# EAGLE design PIC 16F877A Board_V4 (EAGLE 9.6.2)
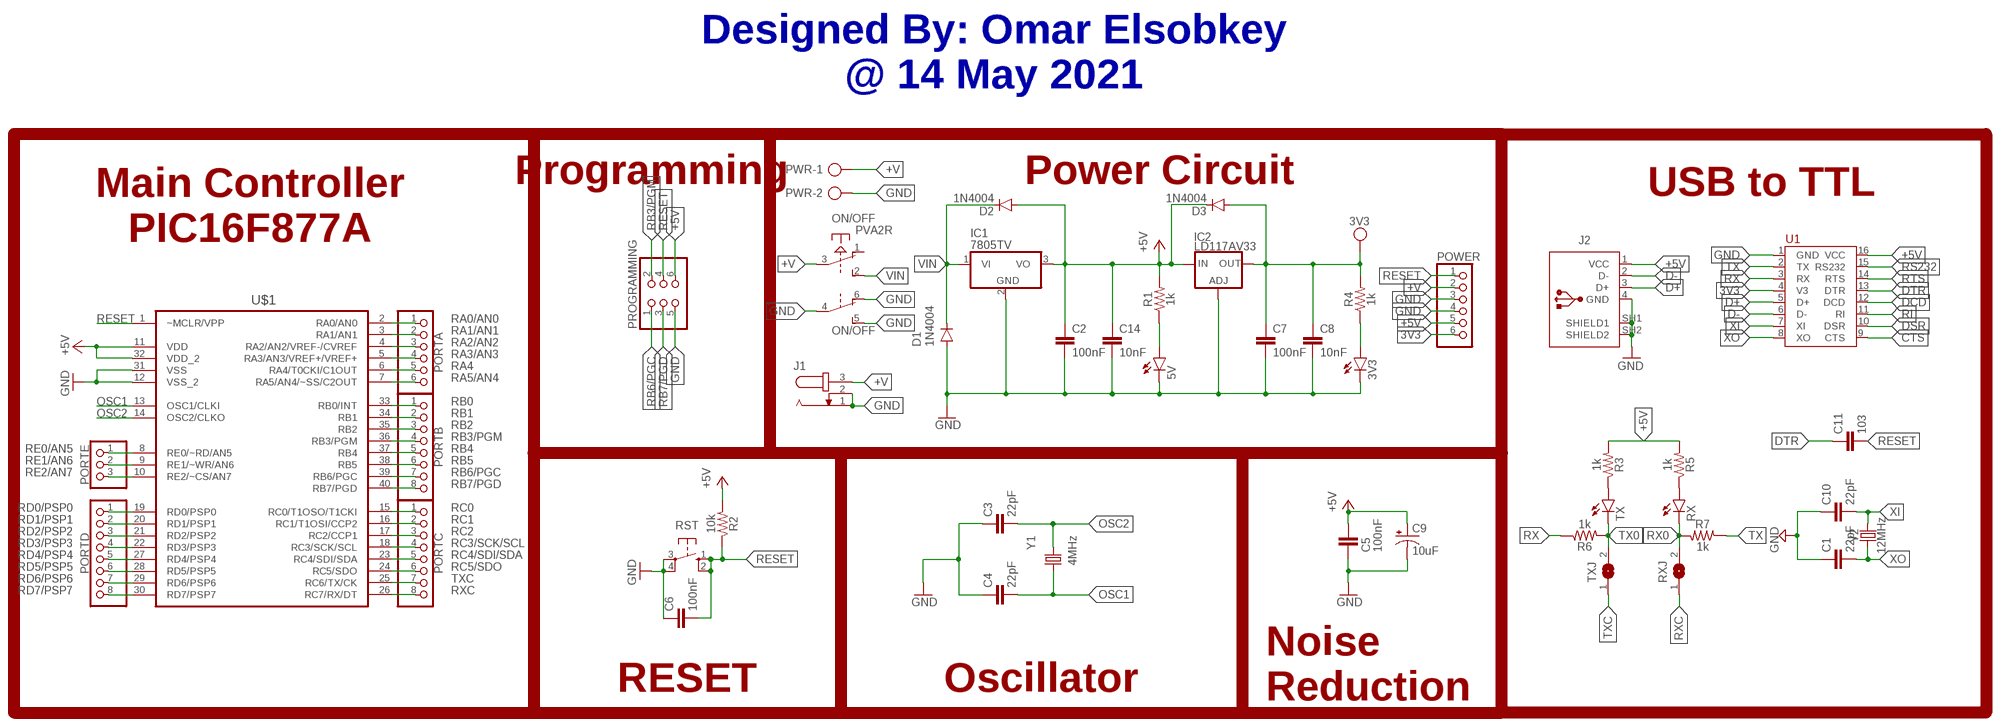
[diagram p0: schematic, sheet 1]

## Parts
3V3  LED3MM  [LED3MM]
5V  LED3MM  [LED3MM]
C1  22pF  C-EU025-025X050  [C025-025X050]
C2  100nF  C-EU025-025X050  [C025-025X050]
C3  22pF  C-EU025-025X050  [C025-025X050]
C4  22pF  C-EU025-025X050  [C025-025X050]
C5  100nF  C-EU025-025X050  [C025-025X050]
C6  100nF  C-EU025-025X050  [C025-025X050]
C7  100nF  C-EU025-025X050  [C025-025X050]
C8  10nF  C-EU025-025X050  [C025-025X050]
C9  10uF  10UF-POLAR-RADIAL-2.5MM-KIT-25V-20%  [CPOL-RADIAL-2.5MM-5MM-KIT]
C10  22pF  C-EU025-025X050  [C025-025X050]
C11  103  C-EU025-025X050  [C025-025X050]
C14  10nF  C-EU025-025X050  [C025-025X050]
D1  1N4004  [DO41-10]
D2  1N4004  [DO41-10]
D3  1N4004  [DO41-10]
IC1  7805TV  [TO220V]
IC2  LD117AV33  [TO220L1]
J1  JACK-PLUG0  [SPC4077]
J2  61729-1011  [61729-1011BLF]
ON/OFF  PVA2R  [PVA2R]
PORTA  PINHD-1X6  [1X06]
PORTB  PINHD-1X8  [1X08]
PORTC  PINHD-1X8  [1X08]
PORTD  PINHD-1X8  [1X08]
PORTE  PINHD-1X3  [1X03]
POWER  PINHD-1X6  [1X06]
PROGRAMMING  PINHD-2X3  [2X03]
PWR  AK500/2-H  [AK500/2-H]
R1  1k  RESISTOR1206  [1206]
R2  10k  RESISTOR1206  [1206]
R3  1k  RESISTOR1206  [1206]
R4  1k  RESISTOR1206  [1206]
R5  1k  RESISTOR1206  [1206]
R6  1k  RESISTOR1206  [1206]
R7  1k  RESISTOR1206  [1206]
RST  10-XX  [B3F-10XX]
RX  LED3MM  [LED3MM]
RXJ  SJW  [SJW]
TX  LED3MM  [LED3MM]
TXJ  SJW  [SJW]
U1  CH340G  [SOP-16]
U$1  PIC16F877A-I/P  [PDIP-40]
Y1  4MHz  CRYSTALPTH-HC49UV  [HC49U]
Y2  12MHz  CRYSTALPTH-HC49UV  [HC49U]

## Nets
3V3: C7.1 C8.1 D3.A IC2.2(OUT) POWER.6 R4.2 U1.4(V3)
+5V: C2.1 C5.2 C9.1(+) C14.1 D2.A D3.C IC1.3(VO) IC2.3(IN) J2.1(VCC) POWER.5 PROGRAMMING.6 R1.2 R2.2 R3.2 R5.2 U1.16(VCC) U$1.11(VDD) U$1.32(VDD_2)
+V: J1.3 ON/OFF.3(1:P) POWER.2 PWR.1
CTS: U1.9(CTS)
D+: J2.3(D+) U1.5(D+)
D-: J2.2(D-) U1.6(D-)
DCD: U1.12(DCD)
DSR: U1.10(DSR)
DTR: C11.1 U1.13(DTR)
GND: 3V3.K(C) 5V.K(C) C1.1 C2.2 C3.1 C4.1 C5.1 C6.1 C7.2 C8.2 C9.2(-) C10.1 C14.2 D1.A IC1.2(GND) IC2.1(ADJ) J1.1 J1.2 J2.4(GND) J2.SH1(SHIELD1) J2.SH2(SHIELD2) ON/OFF.4(2:P) ON/OFF.5(2:S) ON/OFF.6(2:O) POWER.3 POWER.4 PROGRAMMING.5 PWR.2 RST.3(P) RST.4(P1) U1.1(GND) U$1.12(VSS_2) U$1.31(VSS)
N$1: 3V3.A R4.1
N$2: R3.1 TX.A
N$3: R5.1 RX.A
N$4: 5V.A R1.1
OSC1: C4.2 U$1.13(OSC1/CLKI) Y1.2
OSC2: C3.2 U$1.14(OSC2/CLKO) Y1.1
RA0/AN0: PORTA.1 U$1.2(RA0/AN0)
RA1/AN1: PORTA.2 U$1.3(RA1/AN1)
RA2/AN2: PORTA.3 U$1.4(RA2/AN2/VREF-/CVREF)
RA3/AN3: PORTA.4 U$1.5(RA3/AN3/VREF+/VREF+)
RA4: PORTA.5 U$1.6(RA4/T0CKI/C1OUT)
RA5/AN4: PORTA.6 U$1.7(RA5/AN4/~SS/C2OUT)
RB0: PORTB.1 U$1.33(RB0/INT)
RB1: PORTB.2 U$1.34(RB1)
RB2: PORTB.3 U$1.35(RB2)
RB3/PGM: PORTB.4 PROGRAMMING.2 U$1.36(RB3/PGM)
RB4: PORTB.5 U$1.37(RB4)
RB5: PORTB.6 U$1.38(RB5)
RB6/PGC: PORTB.7 PROGRAMMING.1 U$1.39(RB6/PGC)
RB7/PGD: PORTB.8 PROGRAMMING.3 U$1.40(RB7/PGD)
RC0: PORTC.1 U$1.15(RC0/T1OSO/T1CKI)
RC1: PORTC.2 U$1.16(RC1/T1OSI/CCP2)
RC2: PORTC.3 U$1.17(RC2/CCP1)
RC3/SCK/SCL: PORTC.4 U$1.18(RC3/SCK/SCL)
RC4/SDI/SDA: PORTC.5 U$1.23(RC4/SDI/SDA)
RC5/SDO: PORTC.6 U$1.24(RC5/SDO)
RD0/PSP0: PORTD.1 U$1.19(RD0/PSP0)
RD1/PSP1: PORTD.2 U$1.20(RD1/PSP1)
RD2/PSP2: PORTD.3 U$1.21(RD2/PSP2)
RD3/PSP3: PORTD.4 U$1.22(RD3/PSP3)
RD4/PSP4: PORTD.5 U$1.27(RD4/PSP4)
RD5/PSP5: PORTD.6 U$1.28(RD5/PSP5)
RD6/PSP6: PORTD.7 U$1.29(RD6/PSP6)
RD7/PSP7: PORTD.8 U$1.30(RD7/PSP7)
RE0/AN5: PORTE.1 U$1.8(RE0/~RD/AN5)
RE1/AN6: PORTE.2 U$1.9(RE1/~WR/AN6)
RE2/AN7: PORTE.3 U$1.10(RE2/~CS/AN7)
RESET: C6.2 C11.2 POWER.1 PROGRAMMING.4 R2.1 RST.1(S) RST.2(S1) U$1.1(~MCLR/VPP)
RI: U1.11(RI)
RS232: U1.15(RS232)
RTS: U1.14(RTS)
RX: R6.1 U1.3(RX)
RX0: R7.2 RX.K(C) RXJ.2
RXC: PORTC.8 RXJ.1 U$1.26(RC7/RX/DT)
TX: R7.1 U1.2(TX)
TX0: R6.2 TX.K(C) TXJ.2
TXC: PORTC.7 TXJ.1 U$1.25(RC6/TX/CK)
VIN: D1.C D2.C IC1.1(VI) ON/OFF.2(1:S)
XI: C10.2 U1.7(XI) Y2.2
XO: C1.2 U1.8(XO) Y2.1
Unconnected: ON/OFF.1(1:O)

## Notes on the sheet
- Designed By: Omar Elsobkey
  @ 14 May 2021
- Programming | Power Circuit | USB to TTL
- Main Controller
  PIC16F877A
- RESET | Oscillator
- Noise
  Reduction

## Library data of the parts
3V3 5V RX TX = led:LED: LED OSRAM: - CHIPLED LG R971, LG N971, LY N971, LG Q971, LY Q971, LO R971, LY R971 LH N974, LH R974 LS Q976, LO Q976, LY Q976 LO Q996 - Hyper CHIPLED LW Q18S LB Q993, LB Q99A, LB R99A - SideLED LS A670, LO A670, LY A670, LG A670, LP A670 LB A673, LV A673, LT A673, LW A673 LH A674 LY A675 LS A676, LA A676, LO A676, LY A676, LW A676 LS A679, LY A679, LG A679 - Hyper Micro SIDELED® LS Y876, LA Y876, LO Y876, LY Y876 LT Y87S - SmartLED LW L88C, LW L88S LB L89C, LB L89S, LG L890 LS L89K, LO L89K, LY L89K LS L896, LA L896, LO L896, LY L896 - TOPLED LS T670, LO T670, LY T670, LG T670, LP T670 LSG T670, LSP T670, LSY T670, LOP T670, LYG T670 LG T671, LOG T671, LSG T671 LB T673, LV T673, LT T673, LW T673 LH T674 LS T676, LA T676, LO T676, LY T676, LB T676, LH T676, LSB T676, LW T676 LB T67C, LV T67C, LT T67C, LS T67K, LO T67K, LY T67K, LW E67C LS E67B, LA E67B, LO E67B, LY E67B, LB E67C, LV E67C, LT E67C LW T67C LS T679, LY T679, LG T679 LS T770, LO T770, LY T770, LG T770, LP T770 LB T773, LV T773, LT T773, LW T773 LH T774 LS E675, LA E675, LY E675, LS T675 LS T776, LA T776, LO T776, LY T776, LB T776 LHGB T686 LT T68C, LB T68C - Hyper Mini TOPLED® LB M676 - Mini TOPLED Santana® LG M470 LS M47K, LO M47K, LY M47K Source: http://www.osram.convergy.de LUXEON: - LUMILED® LXK2-PW12-R00, LXK2-PW12-S00, LXK2-PW14-U00, LXK2-PW14-V00 LXK2-PM12-R00, LXK2-PM12-S00, LXK2-PM14-U00 LXK2-PE12-Q00, LXK2-PE12-R00, LXK2-PE12-S00, LXK2-PE14-T00, LXK2-PE14-U00 LXK2-PB12-K00, LXK2-PB12-L00, LXK2-PB12-M00, LXK2-PB14-N00, LXK2-PB14-P00, LXK2-PB14-Q00 LXK2-PR12-L00, LXK2-PR12-M00, LXK2-PR14-Q00, LXK2-PR14-R00 LXK2-PD12-Q00, LXK2-PD12-R00, LXK2-PD12-S00 LXK2-PH12-R00, LXK2-PH12-S00 LXK2-PL12-P00, LXK2-PL12-Q00, LXK2-PL12-R00 Source: www.luxeon.com KINGBRIGHT: KA-3528ASYC Source: www.kingbright.com
C1-C8 C10 C11 C14 = rcl:C-EU: CAPACITOR, European symbol; SPICEPREFIX: C
C9 = SparkFun-Capacitors:10UF-POLAR: 10.0µF polarized capacitors A capacitor is a passive two-terminal electrical component used to store electrical energy temporarily in an electric field.
D1-D3 = diode:1N4004: DIODE general purpose rectifier, 1 A
IC1 = linear:78*: Positive VOLTAGE REGULATOR Source: http://cache.national.com/ds/LM/LM78L05.pdf http://www.fairchildsemi.com/ds/LM/LM7805.pdf
IC2 = v-reg:LD117A?*: Low drop fixed and adjustable positive voltage regulators 1 A Source: http://www.st.com/stonline/products/literature/ds/7194/ld1117axx.pdf
J1 = con-jack:JACK-PLUG: DC POWER JACK Power Jack, DC, Right Angle, Through Hole, Rated 5A at 16VDC, PC Terminals Distributor: Farnell (www.Farnell.de) Drawing: 84N1161.pdf / 84N1162.pdf Manufacturer: SPC Technology (www.spctechnology.com) Type: SPC4077 / SPC 4078; OC_FARNELL: unknown; OC_NEWARK: unknown
J2 = Connector_USB:61729-1011: USB(2.0) Type-B, RCPT, 4POS, THT-R/A Datasheet <https://www.amphenol-icc.com/media/wysiwyg/files/drawing/61729.pdf>; CATEGORY: Connector; CONTACTS: 4; CURRENT_RATING: 1A; DESCRIPTION: CONN RCPT USB2.0 TYPEB 4POS R/A; GENDER: Receptacle; MANUFACTURER: Amphenol ICC (FCI); MOUNT_TYPE: R/A; MPN: 61729-1011BLF; OPERATING_TEMP: -55°C to 85°C; PART_STATUS: Active; ROHS_COMPLIANT: RoHS Compliant; SERIES: 61729; SUB-CATEGORY: USB; TYPE: USB-B
ON/OFF = switch-misc:PVA2R: ITT SWITCH
PORTA POWER = pinhead:PINHD-1X6: PIN HEADER
PORTB PORTC PORTD = pinhead:PINHD-1X8: PIN HEADER
PORTE = pinhead:PINHD-1X3: PIN HEADER
PROGRAMMING = pinhead:PINHD-2X3: PIN HEADER
PWR = con-ptr500:AK500/2-H: CONNECTOR Aug. 2004 / PTR Meßtechnik: Die Bezeichnung der Serie AK505 wurde geändert. Es handelt sich hierbei um AK500 in horizontaler Ausführung.; OC_FARNELL: unknown; OC_NEWARK: unknown
R1-R7 = SparkFun-Resistors:RESISTOR: Generic Resistor Package; VALUE: 0
RST = switch-omron:10-XX: OMRON SWITCH; MPN: B3F-1000; OC_FARNELL: 176432; OC_NEWARK: 36M3542
RXJ TXJ = jumper:SJ: SMD solder JUMPER
U1 = CH340G:CH340G
U$1 = PIC:PIC16F877A-I/P: 8-Bit CMOS FLASH Microcontrollers Check prices <https://pricing.snapeda.com/parts/PIC16F877A-I/P/Microchip/view-part?ref=eda>; AVAILABILITY: Good; DESCRIPTION: PIC PIC® 16F Microcontroller IC 8-Bit 20MHz 14KB (8K x 14) FLASH 44-TQFP (10x10); MF: Microchip; MP: PIC16F877A-I/P; PACKAGE: DIP-40 Microchip; PRICE: None; PURCHASE-URL: https://pricing.snapeda.com/search/part/PIC16F877A-I/P/?ref=eda
Y1 Y2 = SparkFun-Clocks:CRYSTAL: Crystals (Generic) These are passive quartz crystals, which can be used as a clock source for a microcontroller. Crystal's are two-terminal devices. They require external "load" capacitors to generate an oscillating signal.

## Board
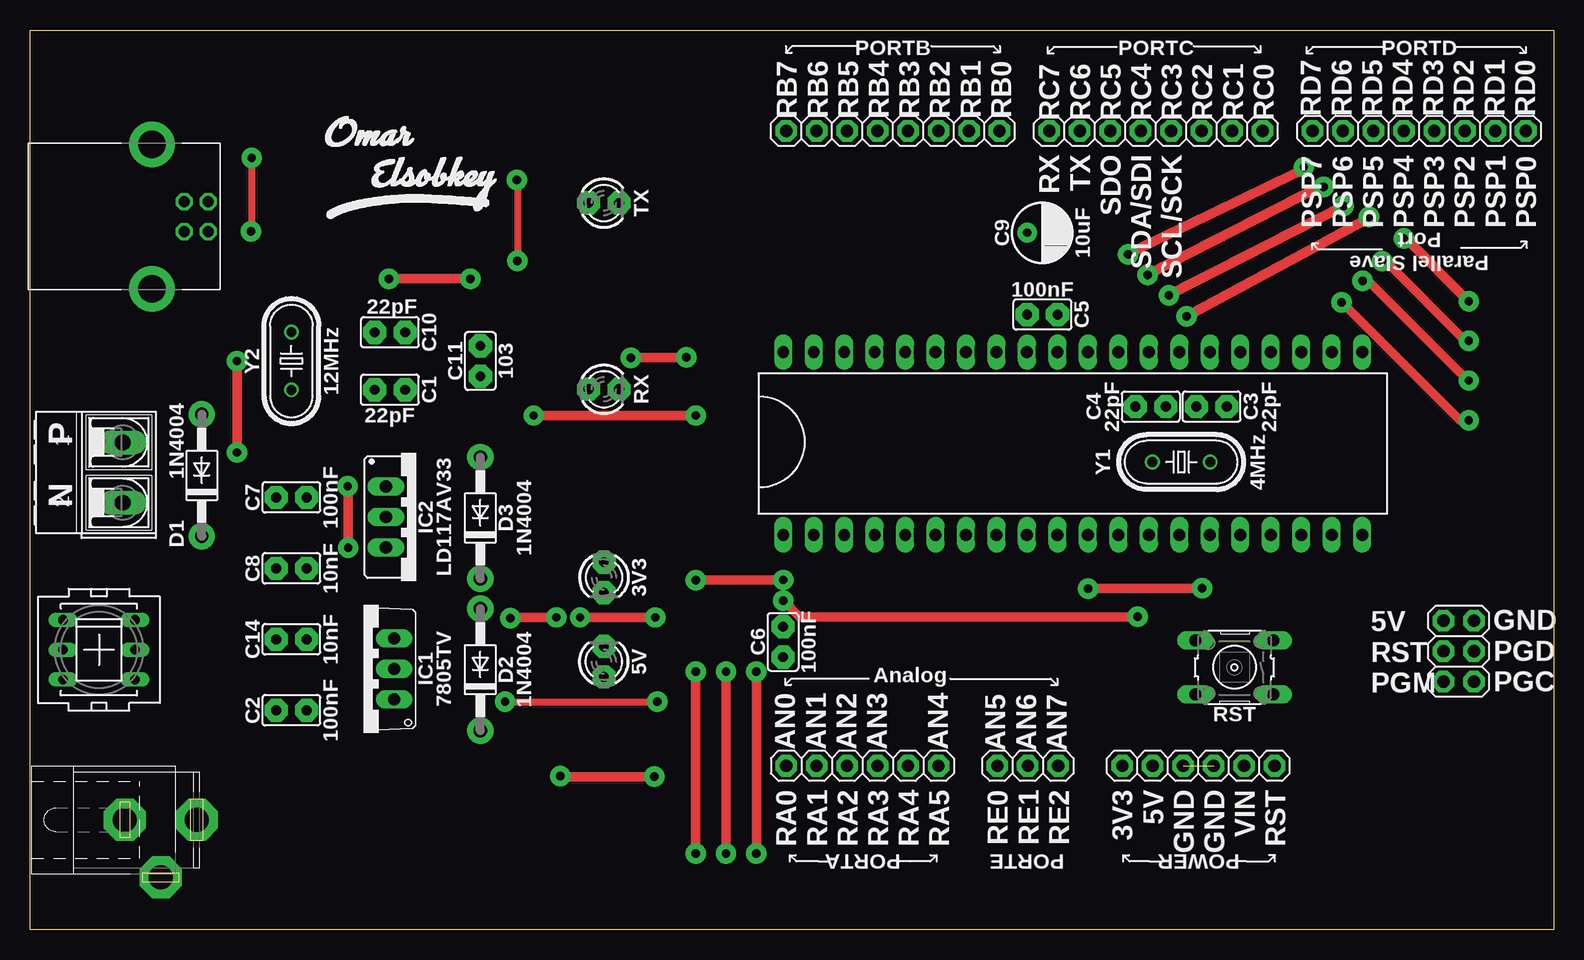
[diagram p1: board, top side]
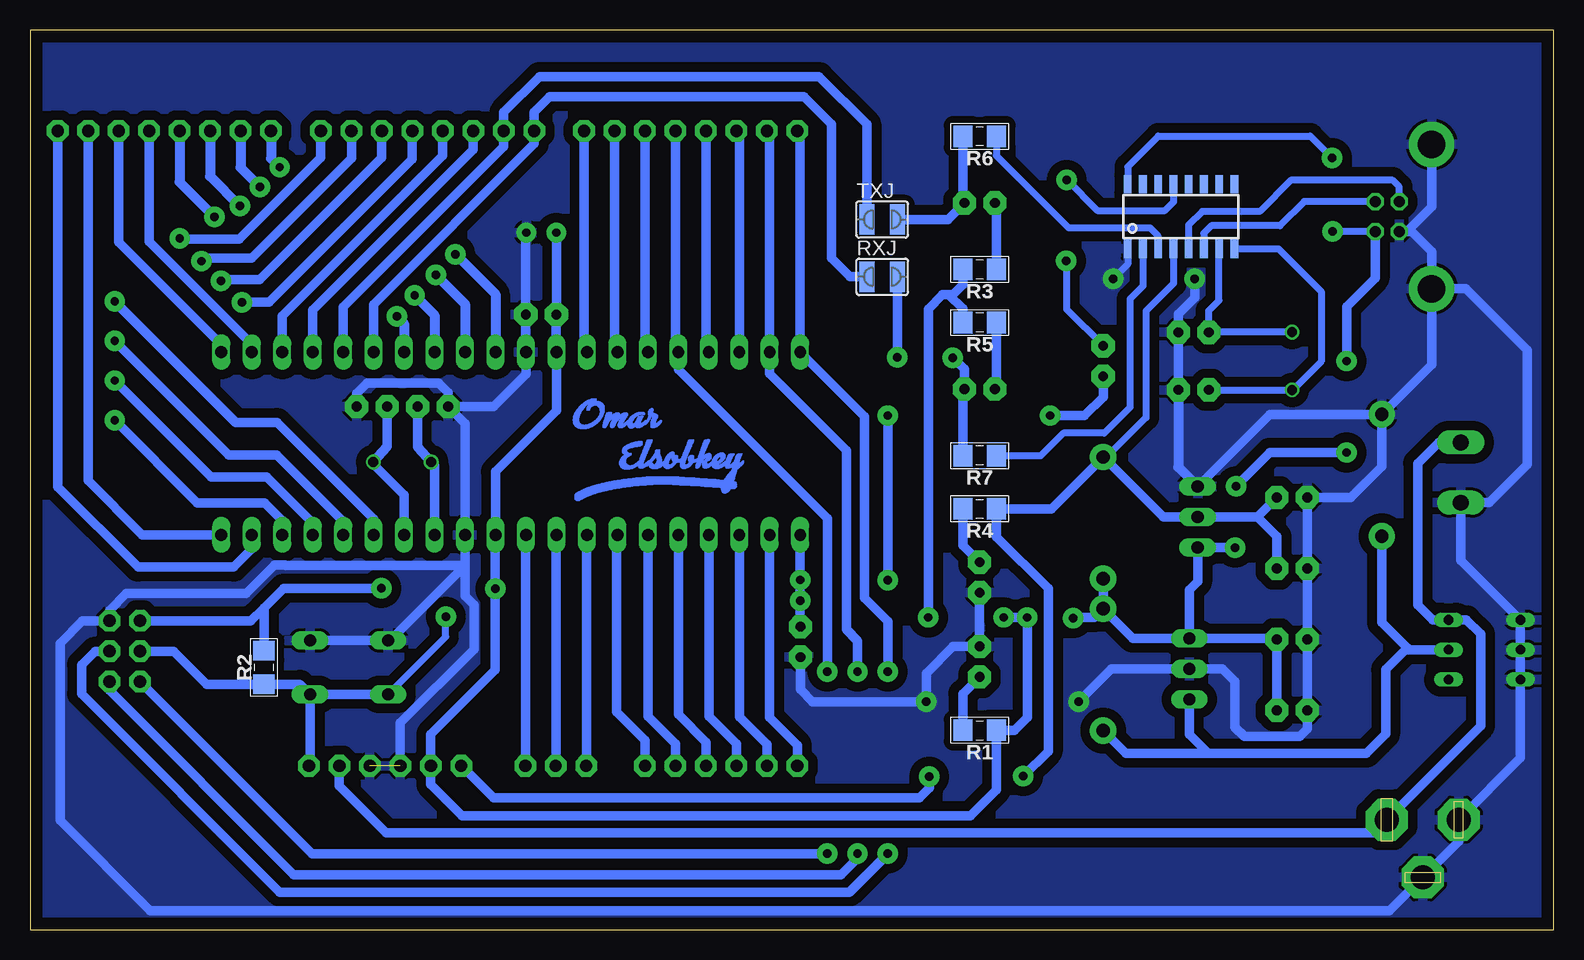
[diagram p2: board, bottom side, seen from below]

Size 127 x 75 mm. Coordinates in mm from the lower left corner, seen from the top.
Outline: 0,75 127,75 127,0 0,0 0,75
Copper layers (1*16): Top 0.035mm / dielectric 1.5mm / Bottom 0.035mm
Design rules "default *": minimum track width 0.6mm, minimum drill 0.6mm, track to track 0.6mm, track to pad 0.6mm, pad to pad 0.6mm, via to via 0.6mm, smd to smd 0.6mm, copper to edge 40mil, drill to drill 6mil, minimum pad ring 5mil, minimum via ring 8mil, stop-mask expansion 4mil, vias tented up to drill 0mil, thermal gap 10mil

### Footprints (pad centres in the part's own frame; a part is rotated, then mirrored left to right if it is on the bottom)
LED3MM = drill 0.813 pad 1.93 octagon: A -1.27,0; K 1.27,0
C025-025X050 = drill 0.813 pad 1.93 octagon: 1 -1.27,0; 2 1.27,0
CPOL-RADIAL-2.5MM-5MM-KIT = drill 0.7 pad 1.651: 1 1.25,0; 2 -1.25,0
DO41-10 = drill 1.118 pad 2.2: A 5.08,0; C -5.08,0
TO220V = drill 1.016 long: 1 -2.54,-2.54; 2 0,-2.54; 3 2.54,-2.54
TO220L1 = drill 1.016 long: 1 -2.54,-2.54; 2 0,-2.54; 3 2.54,-2.54
SPC4077 = drill 2 pad 3.5 octagon: 1 -3,0; 2 0,-4.8; 3 3,0
61729-1011BLF = drill 0.92 pad 1.4 octagon: 1 1.25,4.71; 2 -1.25,4.71; 3 -1.25,2.71; 4 1.25,2.71 | drill 2.3 pad 3.8: SH1 -6.02,0; SH2 6.02,0
PVA2R = drill 0.813 long: 1 -2.997,2.489; 2 -2.997,0; 3 -2.997,-2.489; 4 2.997,2.489; 5 2.997,0; 6 2.997,-2.489
1X06 = drill 1.016 pad 1.8 octagon: 1 -6.35,0; 2 -3.81,0; 3 -1.27,0; 4 1.27,0; 5 3.81,0; 6 6.35,0
1X08 = drill 1.016 pad 1.8 octagon: 1 -8.89,0; 2 -6.35,0; 3 -3.81,0; 4 -1.27,0; 5 1.27,0; 6 3.81,0; 7 6.35,0; 8 8.89,0
1X03 = drill 1.016 pad 1.8 octagon: 1 -2.54,0; 2 0,0; 3 2.54,0
2X03 = drill 1.016 pad 1.8 octagon: 1 -2.54,-1.27; 2 -2.54,1.27; 3 0,-1.27; 4 0,1.27; 5 2.54,-1.27; 6 2.54,1.27
AK500/2-H = drill 1.321 long: 1 -2.515,0; 2 2.515,0
1206 = smd 1.6 x 1.8: 1 -1.4,0; 2 1.4,0
B3F-10XX = drill 1.016 long: 1 -3.251,2.261; 2 3.251,2.261; 3 -3.251,-2.261; 4 3.251,-2.261
SJW = smd 1.27 x 2.54: 1 -1.27,0; 2 1.27,0
SOP-16 = smd 0.635 x 1.524: 1 -4.445,-2.695; 2 -3.175,-2.695; 3 -1.905,-2.695; 4 -0.635,-2.695; 5 0.635,-2.695; 6 1.905,-2.695; 7 3.175,-2.695; 8 4.445,-2.695; 9 4.445,2.695; 10 3.175,2.695; 11 1.905,2.695; 12 0.635,2.695; 13 -0.635,2.695; 14 -1.905,2.695; 15 -3.175,2.695; 16 -4.445,2.695
PDIP-40 = drill 0.991 pad 1.2 long: 1 -7.62,24.13; 2 -7.62,21.59; 3 -7.62,19.05; 4 -7.62,16.51; 5 -7.62,13.97; 6 -7.62,11.43; 7 -7.62,8.89; 8 -7.62,6.35; 9 -7.62,3.81; 10 -7.62,1.27; 11 -7.62,-1.27; 12 -7.62,-3.81; 13 -7.62,-6.35; 14 -7.62,-8.89; 15 -7.62,-11.43; 16 -7.62,-13.97; 17 -7.62,-16.51; 18 -7.62,-19.05; 19 -7.62,-21.59; 20 -7.62,-24.13; 21 7.62,-24.13; 22 7.62,-21.59; 23 7.62,-19.05; 24 7.62,-16.51; 25 7.62,-13.97; 26 7.62,-11.43; 27 7.62,-8.89; 28 7.62,-6.35; 29 7.62,-3.81; 30 7.62,-1.27; 31 7.62,1.27; 32 7.62,3.81; 33 7.62,6.35; 34 7.62,8.89; 35 7.62,11.43; 36 7.62,13.97; 37 7.62,16.51; 38 7.62,19.05; 39 7.62,21.59; 40 7.62,24.13
HC49U = drill 0.813: 1 -2.413,0; 2 2.413,0

### Placement (x,y rotation side)
3V3  47.84,29.35 270 top
5V  47.84,22.33 90 top
C1  30,45 180 top
C2  21.79,18.28 180 top
C3  98.5,43.6 180 top
C4  93.43,43.6 0 top
C5  84.4,51.27 180 top
C6  62.78,23.98 90 top
C7  21.79,36.02 180 top
C8  21.79,30.11 180 top
C9  84.38,58.1 180 top
C10  30,49.8 180 top
C11  37.54,47.4 270 top
C14  21.79,24.19 180 top
D1  14.31,37.86 90 top
D2  37.54,21.66 90 top
D3  37.54,34.31 90 top
IC1  27.81,21.74 90 top
IC2  32.2,34.39 270 top
J1  10.92,9.15 0 top
J2  10.15,59.45 270 top
ON/OFF  5.75,23.32 180 top
PORTA  69.39,13.65 0 top
PORTB  71.92,66.59 180 top
PORTC  93.86,66.59 180 top
PORTD  115.8,66.59 180 top
PORTE  83.17,13.65 0 top
POWER  97.4,13.65 180 top
PROGRAMMING  119.1,23.21 90 top
PWR  7.72,38.1 270 top
R1  47.84,16.61 0 bottom
R2  107.49,21.86 90 bottom
R3  47.84,55.03 180 bottom
R4  47.84,35.08 0 bottom
R5  47.84,50.6 180 bottom
R6  47.84,66.12 180 bottom
R7  47.84,39.51 180 bottom
RST  100.4,21.86 180 top
RX  47.84,45.05 0 top
RXJ  55.96,54.42 0 bottom
TX  47.84,60.58 0 top
TXJ  55.96,59.2 0 bottom
U1  31.05,59.45 0 bottom
U$1  86.92,40.52 90 top
U$2  [OMAR_ELSOBKEY_X1_T]  75.4,40.12 0 bottom
U$3  [OMAR_ELSOBKEY_X1_TN]  30.95,63.65 0 top
U$4  [OMAR_ELSOBKEY_X1_P]  75.4,40.12 0 bottom
Y1  95.98,38.97 180 top
Y2  21.79,47.4 90 top

### Tracks (layer width: path | path; a pad name or v marks a point on that pad's centre or on a via)
3V3  (via drill 0.7 pad 1.7)
  Top 0.8: v52.02,12.75 44.25,12.75 v44.2,12.8
  Bottom 0.6: U1.4 31.69,53.86 33.98,51.58 33.98,42.67 37.26,39.39 D3.A
  Bottom 0.8: 24.7,34.39 IC2.2 32.53,34.39 D3.A 41.85,35.08 R4.2 46.44,32.74 42.12,28.43 42.12,14.88 v44.2,12.8 | 24.7,34.39 C7.1 | 24.7,34.39 23.06,32.75 C8.1 | POWER.6 91.03,13.65 88.35,10.97 52.85,10.97 52.02,11.8 v52.02,12.75
+5V  (via drill 0.7 pad 1.7)
  Top 0.6: v18.48,64.35 18.48,58.25 v18.43,58.2
  Top 0.8: v97.7,28.45 88.25,28.45 v88.22,28.43 | v26.52,31.82 26.52,36.9 v26.48,36.95 | v17.25,39.77 v17.25,47.4 | v52.12,26.02 v45.85,26.02 | v43.88,26.02 40.08,26.02 v40.02,25.98
  Bottom 0.6: J2.1 v18.43,58.2 | v18.48,64.35 20.27,66.15 32.95,66.15 35.5,63.6 U1.16
  Bottom 0.8: C9.1 C5.2 83.13,48.16 U$1.32 83.11,43.26 88.19,38.18 U$1.11 88.22,32.88 v88.22,28.43 88.22,21.66 93.59,16.29 POWER.5 93.59,12.09 90.97,9.47 48.6,9.47 46.44,11.63 R1.2 44.94,16.61 43.88,17.68 v43.88,26.02 v45.85,26.02 | D3.C D2.A | IC1.3 35.07,24.28 D2.A | D2.A 38.26,26.02 39.98,26.02 v40.02,25.98 | IC1.3 23.14,24.28 C14.1 C2.1 | IC1.3 30.35,28.32 29.66,29.02 IC2.3 26.55,31.85 v26.52,31.82 | v17.25,47.4 17.25,51.95 14.87,54.33 J2.1 | v52.12,26.02 52.12,51.75 50.92,52.95 50.43,52.95 | PROGRAMMING.6 117.81,25.72 108.6,25.72 107.5,26.82 | v17.25,39.77 23.65,39.77 v26.48,36.95 | 49.48,54.79 R3.2 49.24,53.79 50.08,52.95 50.43,52.95 | R5.2 49.24,51.76 50.43,52.95 | 107.5,26.82 105.88,28.45 v97.7,28.45 | 107.5,26.82 R2.2
+V
  Bottom 0.8: PWR.1 9.57,40.62 11.33,38.86 11.33,27.07 10.07,25.81 ON/OFF.3 7.25,25.81 6.08,24.64 6.08,16.99 J1.3 14.99,8.07 97.3,8.07 101.21,11.98 POWER.2
D+
  Bottom 0.6: J2.3 12.86,61.94 13.4,62.48 21.9,62.48 24.5,59.88 29.27,59.88 30.42,58.73 U1.5
D-
  Bottom 0.6: U1.6 29.15,58.05 28.53,58.67 22.81,58.67 20.77,60.7 J2.2
DTR  (via drill 0.7 pad 1.7)
  Top 0.6: v40.58,62.5 40.62,62.45 v40.62,55.75
  Bottom 0.6: U1.13 31.69,60.66 32.45,59.9 37.97,59.9 v40.58,62.5 | v40.62,55.75 40.59,55.71 40.59,51.72 C11.1
GND  (via drill 0.7 pad 1.7)  (1 unrouted)
  Top 0.6: v39.6,19 v52.27,19
  Top 0.8: v29.93,54.25 v29.93,54.26 v36.71,54.26 | v52.27,19 52.25,19.02 | 39.62,19.02 v39.6,19
  Bottom 0.6: U1.1 35.5,55.47 v36.71,54.26
  Bottom 0.8: 96.48,24.12 RST.4 | C9.2 85.67,58.05 C5.1 85.67,48.16 U$1.31 85.66,46.3 88.35,43.6 C4.1 | J2.SH2 10.15,56.52 11.82,58.2 J2.4 12.22,58.2 10.15,60.27 J2.SH1 | J2.SH2 7.3,53.43 2.17,48.3 2.17,38.77 5.36,35.59 PWR.2 7.72,30.79 ON/OFF.6 ON/OFF.5 ON/OFF.4 2.75,14.31 J1.1 7.92,7.35 J1.2 13.69,1.57 116.97,1.57 124.5,9.1 124.5,23.88 122.63,25.75 PROGRAMMING.5 120.37,26.62 118.96,28.02 109,28.02 106.62,30.4 105.72,30.4 105.69,30.36 90.73,30.36 | C1.1 C10.1 31.27,51.3 29.9,52.67 29.9,54.22 v29.93,54.25 | 3V3.K 5V.K 50.05,23.6 52.27,21.38 v52.27,19 61.77,19 62.78,20 C6.1 | 90.73,30.36 U$1.12 90.73,42.18 C4.1 | RST.4 96.98,24.12 90.73,30.36 | RST.4 RST.3 | 90.73,30.36 90.73,27.81 90,27.07 90,23.35 96.13,17.22 POWER.4 | C4.1 92.16,44.78 92.94,45.56 98.89,45.56 99.77,44.68 C3.1 | D1.A 14.31,38.61 16.9,36.02 C7.2 C8.2 C14.2 C2.2 20.52,16.73 21.15,16.1 25.77,16.1 26.55,16.88 26.55,20.7 27.59,21.74 IC1.2 36.86,21.74 v39.6,19 | D1.A 23.65,42.94 IC2.1 | J2.SH2 10.15,47.11 D1.A
  Bottom 0.813: C1.1 31.27,38.54 IC2.1
  pour Bottom (isolate 0.8): -3.02,76.53 128.75,76.53 128.75,-1.82 -3.02,-1.82
N$1
  Bottom 0.8: R4.1 49.24,32.02 3V3.A
N$2
  Bottom 0.8: R3.1 46.44,60.45 TX.A
N$3
  Bottom 0.8: R5.1 46.44,45.19 RX.A
N$4
  Bottom 0.8: 5V.A 49.24,19.66 R1.1
OSC1
  Bottom 0.8: 93.25,32.93 U$1.13 93.28,38.69 Y1.2 94.7,40.23 C4.2
OSC2
  Bottom 0.8: C3.2 97.23,40.26 Y1.1 98.54,38.95 95.81,36.23 U$1.14
RA0/AN0
  Bottom 0.8: U$1.2 65.33,17.68 63.03,15.38 PORTA.1
RA1/AN1
  Bottom 0.8: PORTA.2 65.58,15.43 67.88,17.73 U$1.3
RA2/AN2
  Bottom 0.8: U$1.4 70.42,17.77 68.11,15.47 PORTA.3
RA3/AN3
  Bottom 0.8: U$1.5 72.95,17.93 70.66,15.62 PORTA.4
RA4
  Bottom 0.8: PORTA.5 73.19,15.47 75.5,17.78 75.5,30.55 U$1.6
RA5/AN4
  Bottom 0.8: U$1.7 78.11,32.83 78.11,18.15 75.73,15.78 PORTA.6
RB0
  Bottom 0.8: PORTB.1 80.83,66.58 80.83,48.4 U$1.33
RB1
  Bottom 0.8: PORTB.2 78.28,66.58 78.28,48.4 U$1.34
RB2
  Bottom 0.8: PORTB.3 75.75,66.58 75.75,48.4 U$1.35
RB3/PGM  (via drill 0.7 pad 1.7)
  Top 0.8: v60.55,21.5 v60.55,6.33
  Bottom 0.8: PORTB.4 73.2,66.58 73.2,48.4 U$1.36 72.95,46.7 60.5,34.25 60.5,21.55 v60.55,21.5 | v60.55,6.33 103.49,6.33 PROGRAMMING.2
RB4
  Bottom 0.8: PORTB.5 70.67,66.58 70.67,48.4 U$1.37
RB5
  Bottom 0.8: PORTB.6 67.88,66.35 U$1.38
RB6/PGC  (via drill 0.7 pad 1.7)
  Top 0.8: v58.02,21.5 v58.02,6.33
  Bottom 0.8: PORTB.7 65.33,66.35 U$1.39 65.33,46.34 58.94,39.94 58.94,25 58.02,24.08 v58.02,21.5 | v58.02,6.33 58.02,5.93 59.38,4.57 105.02,4.57 120.37,19.92 PROGRAMMING.1
RB7/PGD  (via drill 0.7 pad 1.7)
  Top 0.8: v55.49,21.5 v55.49,6.33
  Bottom 0.8: PORTB.8 62.8,66.35 U$1.40 57.42,42.77 57.42,27.64 55.49,25.7 v55.49,21.5 | 58.69,3.12 106.17,3.12 122.7,19.65 122.7,22.07 121.57,23.21 PROGRAMMING.3
  Bottom 0.813: v55.49,6.33 58.69,3.12
RC0  (via drill 0.7 pad 1.7)
  Top 0.813: v119.94,52.38 114.69,57.62 v114.53,57.62
  Bottom 0.8: U$1.15 98.36,34.23 106.4,42.27 109.84,42.27 | PORTC.1 102.75,64.37 109.55,57.58 114.47,57.58 v114.53,57.62
  Bottom 0.813: v119.94,52.38 109.84,42.27
RC1  (via drill 0.7 pad 1.7)
  Top 0.8: v119.94,49.07 119.67,49.07 113.01,55.73 v112.72,55.73
  Bottom 0.8: U$1.16 100.89,34.02 106.45,39.58 110.44,39.58 v119.94,49.07 | PORTC.2 100.19,66.56 100.19,64.31 108.53,55.98 112.47,55.98 v112.72,55.73
RC2  (via drill 0.7 pad 1.7)
  Top 0.8: v119.94,45.77 119.85,45.77 111.52,54.1 v111.07,54.1
  Bottom 0.8: U$1.17 103.44,33.88 107.28,37.73 111.89,37.73 v119.94,45.77 | v111.07,54.1 111,54.17 107.86,54.17 97.67,64.36 PORTC.3
RC3/SCK/SCL  (via drill 0.7 pad 1.7)
  Top 0.8: v119.94,42.47 119.18,42.47 v109.35,52.3
  Bottom 0.8: U$1.18 105.97,34.1 107.45,35.58 113.05,35.58 v119.94,42.46 v119.94,42.47 | v109.35,52.3 107.08,52.3 95.13,64.24 PORTC.4
RC4/SDI/SDA
  Bottom 0.8: U$1.23 105.97,51.15 92.59,64.53 PORTC.5
RC5/SDO
  Bottom 0.8: U$1.24 103.44,51.64 90.05,65.02 PORTC.6
RD0/PSP0
  Bottom 0.8: PORTD.1 124.69,36.91 117.99,30.22 110.01,30.22 108.52,31.71 U$1.19
RD1/PSP1
  Bottom 0.8: U$1.20 117.63,32.91 122.15,37.42 PORTD.2
RD2/PSP2
  Bottom 0.8: PORTD.3 119.61,57.33 111.06,48.77 U$1.21
RD3/PSP3
  Bottom 0.8: PORTD.4 117.07,57.37 108.52,48.81 U$1.22
RD4/PSP4  (via drill 0.7 pad 1.7)
  Top 0.813: v111.64,59.42 111.45,59.24 v96.43,51.13
  Bottom 0.813: PORTD.5 114.53,62.32 v111.64,59.42 | v96.43,51.13 95.81,50.51 U$1.27
RD5/PSP5  (via drill 0.7 pad 1.7)
  Top 0.813: v94.94,52.88 109.46,60.31 v109.51,60.32
  Bottom 0.813: PORTD.6 111.99,62.8 v109.51,60.32 | v94.94,52.88 93.28,51.22 U$1.28
RD6/PSP6  (via drill 0.7 pad 1.7)
  Top 0.813: v93.18,54.59 107.52,61.93 v107.85,61.93
  Bottom 0.813: PORTD.7 109.45,63.53 v107.85,61.93 | v93.18,54.59 90.73,52.15 U$1.29
RD7/PSP7  (via drill 0.7 pad 1.7)
  Top 0.813: v91.53,56.3 105.96,63.28 v106.19,63.56
  Bottom 0.813: PORTD.8 106.91,64.28 v106.19,63.56 | v91.53,56.3 88.19,52.97 U$1.30
RE0/AN5
  Bottom 0.8: PORTE.1 80.6,13.69 80.6,32.88 U$1.8
RE1/AN6
  Bottom 0.8: U$1.9 83.14,32.88 83.14,13.69 PORTE.2
RE2/AN7
  Bottom 0.8: PORTE.3 85.68,13.69 85.68,32.88 U$1.10
RESET  (via drill 0.7 pad 1.7)
  Top 0.8: v92.35,26.07 64.15,26.07 v62.8,27.42 | v55.5,42.85 v41.98,42.85 | v55.5,29.12 55.52,29.15 v62.8,29.15
  Bottom 0.6: RST.2 92.35,24.4 v92.35,26.07
  Bottom 0.8: C6.2 62.8,25.28 v62.8,27.42 v62.8,29.15 62.8,32.9 U$1.1 | RST.2 RST.1 | v41.98,42.85 39.1,42.85 37.54,44.41 C11.2 | v55.5,42.85 v55.5,29.12 | POWER.1 103.66,13.74 RST.1 | PROGRAMMING.4 115.01,23.21 112.26,20.46 R2.1 104.52,20.46 RST.1
RX
  Bottom 0.6: R6.1 46.44,64.53 40.41,58.5 33.62,58.5 33.01,57.89 33.01,57.85 32.96,57.8 U1.3
RX0  (via drill 0.7 pad 1.7)
  Top 0.8: v50.08,47.67 54.67,47.67 v54.7,47.7
  Bottom 0.8: R7.2 49.24,44.92 RX.K 49.11,46.71 v50.08,47.67 | v54.7,47.7 v54.69,47.71 RXJ.2
RXC
  Bottom 0.8: U$1.26 98.36,52.12 84.97,65.5 PORTC.8 84.97,68.15 83.67,69.45 62.5,69.45 60.2,67.15 60.2,55.99 58.63,54.42 RXJ.1
TX
  Bottom 0.6: U1.2 34.23,53.66 35.31,52.57 35.31,43.54 37.46,41.39 40.85,41.39 42.74,39.51 R7.1
TX0
  Bottom 0.8: TXJ.2 50.49,59.2 TX.K 49.24,60.71 R6.2
TXC
  Bottom 0.8: U$1.25 100.89,51.91 87.51,65.29 PORTC.7 87.51,68.14 84.53,71.12 61.23,71.12 57.23,67.13 TXJ.1
VIN
  Bottom 0.8: 28.77,14.7 30.35,16.28 IC1.1 | 28.77,14.7 35.65,14.7 D2.C 37.57,16.58 | 28.77,14.7 15.6,14.7 14,16.3 14,21.68 12.35,23.32 | ON/OFF.2 12.35,23.32 | D1.C 14.31,25.59 12.2,23.48 12.35,23.32
XI
  Bottom 0.6: Y2.2 28.72,49.81 C10.2 28.73,51.6 27.88,52.45 U1.7
XO
  Bottom 0.6: C1.2 21.8,45 | 21.8,45 Y2.1 | U1.8 22.93,56.76 19.38,53.2 19.38,47.38 21.75,45 21.8,45

### Text on the board
tNames: RD7 / RD6 / RD5 / RD4 / RD3 / RD2 / RD1 / RD0 | RB7 / RB6 / RB5 / RB4 / RB3 / RB2 / RB1 / RB0 | RC7 / RC6 / RC5 / RC4 / RC3 / RC2 / RC1 / RC0 | RX / TX / SDO / SDA/SDI / SCL/SCK | PSP7 / PSP6 / PSP5 / PSP4 / PSP3 / PSP2 / PSP1 / PSP0 | Parallel Slave / Port | P | N | Analog | AN0 / AN1 / AN2 / AN3 / / AN4 | AN5 / AN6 / AN7 | 5V / RST / PGM | GND / PGD / PGC | RA0 / RA1 / RA2 / RA3 / RA4 / RA5 | RE0 / RE1 / RE2 | 3V3 / 5V / GND / GND / VIN / RST